# Altium project DSO_Project.PrjPCB
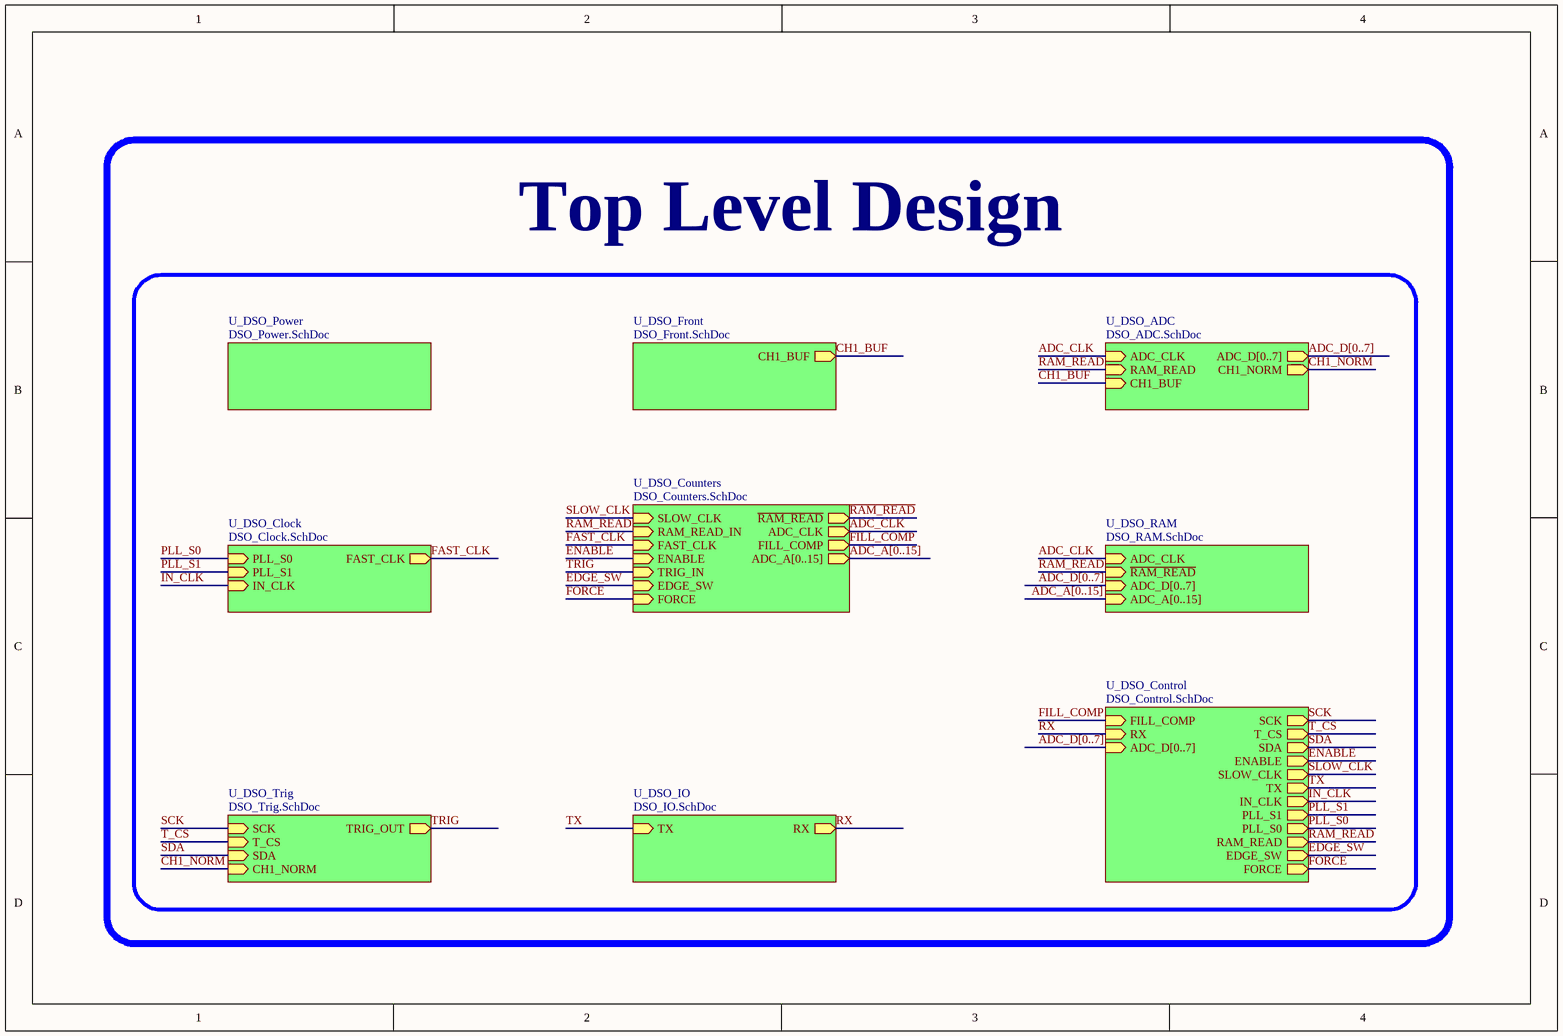
[diagram p0: DSO_Top.SchDoc]
11 sheets, 131 parts. Net scope: hierarchical (ports join the sheet entries above them; power ports are global).
Board file: DSO.PcbDoc
Sheets:
  DSO_Top.SchDoc
    U_DSO_ADC = DSO_ADC.SchDoc
    U_DSO_Clock = DSO_Clock.SchDoc
    U_DSO_Control = DSO_Control.SchDoc
    U_DSO_Counters = DSO_Counters.SchDoc
      U_DSO_CPLD = DSO_CPLD.SchDoc
    U_DSO_Front = DSO_Front.SchDoc
    U_DSO_IO = DSO_IO.SchDoc
    U_DSO_Power = DSO_Power.SchDoc
    U_DSO_RAM = DSO_RAM.SchDoc
    U_DSO_Trig = DSO_Trig.SchDoc

## Sheet DSO_Top.SchDoc: Schematic_Name
size A4; CompanyName: University of Melbourne; Engineer: Your Name Here; DocumentNumber: 1; Revision: 0.1; SheetNumber: 1; SheetTotal: 1; Title_Project: Project_Title; StudentNo: Student No.

### Sub-sheets
U_DSO_ADC = DSO_ADC.SchDoc: ADC_CLK (in), ADC_D[0..7] (out), RAM_READ (in), CH1_BUF (in), CH1_NORM (out)
U_DSO_Clock = DSO_Clock.SchDoc: FAST_CLK (out), PLL_S0 (in), IN_CLK (in), PLL_S1 (in)
U_DSO_Control = DSO_Control.SchDoc: SCK (out), T_CS (out), SDA (out), ENABLE (out), FILL_COMP (in), SLOW_CLK (out), TX (out), RX (in), IN_CLK (out), PLL_S1 (out), PLL_S0 (out), RAM_READ (out), ADC_D[0..7] (in), EDGE_SW (out), FORCE (out)
U_DSO_Counters = DSO_Counters.SchDoc: SLOW_CLK (in), ~{RAM_READ} (out), ADC_CLK (out), RAM_READ_IN (in), FAST_CLK (in), FILL_COMP (out), ENABLE (in), TRIG_IN (in), EDGE_SW (in), FORCE (in), ADC_A[0..15] (out)
U_DSO_Front = DSO_Front.SchDoc: CH1_BUF (out)
U_DSO_IO = DSO_IO.SchDoc: TX (in), RX (out)
U_DSO_Power = DSO_Power.SchDoc: no entries
U_DSO_RAM = DSO_RAM.SchDoc: ADC_CLK (in), ~{RAM_READ} (in), ADC_D[0..7] (in), ADC_A[0..15] (in)
U_DSO_Trig = DSO_Trig.SchDoc: TRIG_OUT (out), SCK (in), T_CS (in), SDA (in), CH1_NORM (in)

### Nets
ADC_CLK: sheet U_DSO_ADC/ADC_CLK, sheet U_DSO_Counters/ADC_CLK, sheet U_DSO_RAM/ADC_CLK
CH1_BUF: sheet U_DSO_ADC/CH1_BUF, sheet U_DSO_Front/CH1_BUF
CH1_NORM: sheet U_DSO_ADC/CH1_NORM, sheet U_DSO_Trig/CH1_NORM
EDGE_SW: sheet U_DSO_Control/EDGE_SW, sheet U_DSO_Counters/EDGE_SW
ENABLE: sheet U_DSO_Control/ENABLE, sheet U_DSO_Counters/ENABLE
FAST_CLK: sheet U_DSO_Clock/FAST_CLK, sheet U_DSO_Counters/FAST_CLK
FILL_COMP: sheet U_DSO_Control/FILL_COMP, sheet U_DSO_Counters/FILL_COMP
FORCE: sheet U_DSO_Control/FORCE, sheet U_DSO_Counters/FORCE
IN_CLK: sheet U_DSO_Clock/IN_CLK, sheet U_DSO_Control/IN_CLK
PLL_S0: sheet U_DSO_Clock/PLL_S0, sheet U_DSO_Control/PLL_S0
PLL_S1: sheet U_DSO_Clock/PLL_S1, sheet U_DSO_Control/PLL_S1
~{RAM_READ}: sheet U_DSO_Counters/~{RAM_READ}, sheet U_DSO_RAM/~{RAM_READ}
RAM_READ: sheet U_DSO_ADC/RAM_READ, sheet U_DSO_Control/RAM_READ, sheet U_DSO_Counters/RAM_READ_IN
RX: sheet U_DSO_Control/RX, sheet U_DSO_IO/RX
SCK: sheet U_DSO_Control/SCK, sheet U_DSO_Trig/SCK
SDA: sheet U_DSO_Control/SDA, sheet U_DSO_Trig/SDA
SLOW_CLK: sheet U_DSO_Control/SLOW_CLK, sheet U_DSO_Counters/SLOW_CLK
T_CS: sheet U_DSO_Control/T_CS, sheet U_DSO_Trig/T_CS
TRIG: sheet U_DSO_Counters/TRIG_IN, sheet U_DSO_Trig/TRIG_OUT
TX: sheet U_DSO_Control/TX, sheet U_DSO_IO/TX

### Buses and harness runs
bus ADC_A[0..15] = sheet U_DSO_Counters/ADC_A[0..15]
bus ADC_A[0..15] = sheet U_DSO_RAM/ADC_A[0..15]
bus ADC_D[0..7] = sheet U_DSO_ADC/ADC_D[0..7]
bus ADC_D[0..7] = sheet U_DSO_Control/ADC_D[0..7]
bus ADC_D[0..7] = sheet U_DSO_RAM/ADC_D[0..7]

### Notes on the sheet
- Top Level Design

## Sheet DSO_ADC.SchDoc: Schematic_Name
size A4; CompanyName: University of Melbourne; Engineer: Your Name Here; DocumentNumber: 1; Revision: 0.1; SheetNumber: 1; SheetTotal: 1; Title_Project: Project_Title; StudentNo: Student No.
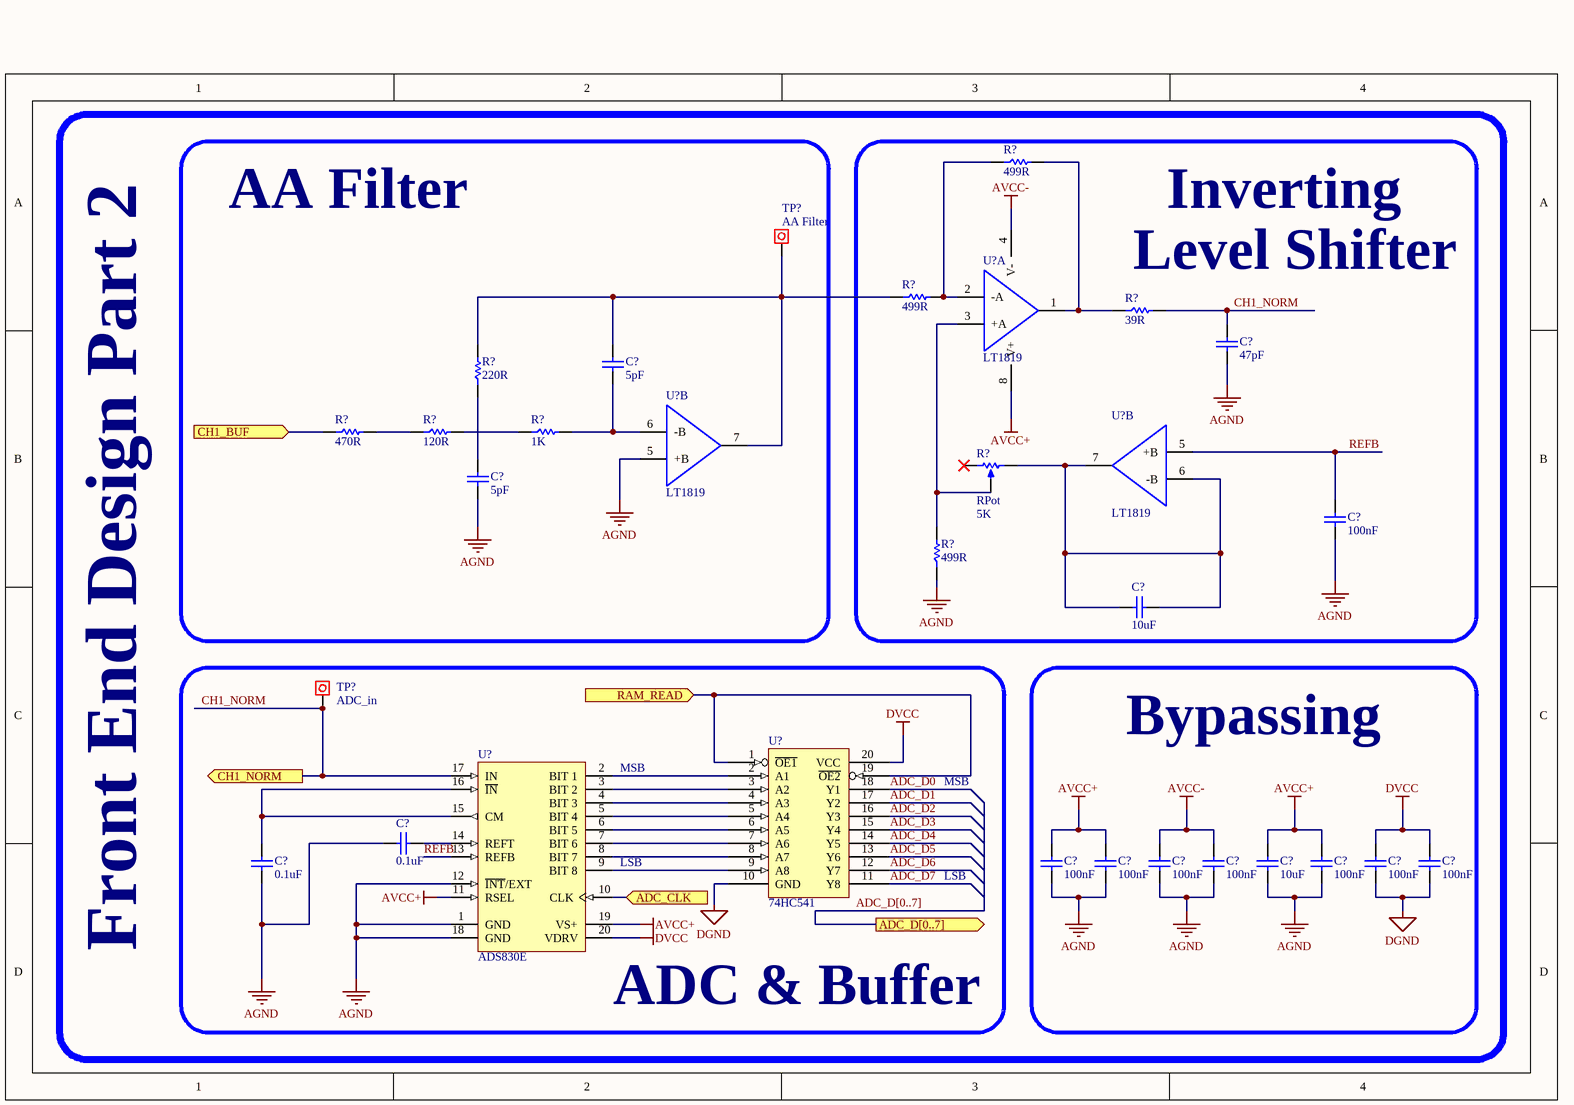
[diagram p1: DSO_ADC.SchDoc]

### Parts
(Parts that share a designator on the sheet are numbered #1, #2 ... from top to bottom, then left to right.)
C?#1  47pF  [0805C]
C?#2  5pF  [0805C]
C?#3  5pF  [0805C]
C?#4  100nF  [0805C]
C?#5  10uF  [0805C]
C?#6  0.1uF  [0805C]
C?#7  100nF  [0805C]
C?#8  100nF  [0805C]
C?#9  100nF  [0805C]
C?#10  100nF  [0805C]
C?#11  10uF  [0805C]
C?#12  100nF  [0805C]
C?#13  100nF  [0805C]
C?#14  100nF  [0805C]
C?#15  0.1uF  [0805C]
R?#1  499R  [0805]
R?#2  499R  [0805]
R?#3  39R  [0805]
R?#4  220R  [0805]
R?#5  470R  [0805]
R?#6  120R  [0805]
R?#7  1K  [0805]
R?#8  RPot  value 5K  [VR5]
R?#9  499R  [0805]
TP?#1  value AA Filter  [Testpoin]  (hidden comment: INPUT)
TP?#2  value ADC_in  [Testpoin]  (hidden comment: INPUT)
U?#1  LT1819  [SOIC-8]  (part A of 2)
U?#2  LT1819  [SOIC-8]  (part B of 2)
U?#3  LT1819  [SOIC-8]  (part B of 2)
U?#4  ADS830E  [TI-DBQ20_L]
U?#5  74HC541  [SOT163-1_N]

### Blocks framed on the sheet
AA Filter: C?#2 C?#3 R?#4-R?#7 TP?#1 U?#3
ADC & Buffer: C?#6 C?#15 TP?#2 U?#4 U?#5
Bypassing: C?#7-C?#14

### Ports
ADC_CLK (in), ADC_D[0..7] (out), CH1_BUF (in), CH1_NORM (out), RAM_READ (in)

### Nets
AGND: C?#1.2 C?#3.2 C?#4.2 C?#6.1 C?#7.1 C?#8.1 C?#9.1 C?#10.1 C?#11.1 C?#12.1 C?#15.2 R?#9.1 U?#3.5(+B) U?#4.1(GND) U?#4.12(~{INT}/EXT) U?#4.18(GND)
AVCC+: C?#7.2 C?#8.2 C?#11.2 C?#12.2 U?#1.8(V+) U?#4.11(RSEL) U?#4.19(VS+)
AVCC-: C?#9.2 C?#10.2 U?#1.4(V-)
DGND: C?#13.1 C?#14.1 U?#5.10(GND)
DVCC: C?#13.2 C?#14.2 U?#4.20(VDRV) U?#5.20(VCC)
ADC_CLK: U?#4.10(CLK) ; port ADC_CLK
ADC_D0: U?#5.18(Y1)
ADC_D1: U?#5.17(Y2)
ADC_D2: U?#5.16(Y3)
ADC_D3: U?#5.15(Y4)
ADC_D4: U?#5.14(Y5)
ADC_D5: U?#5.13(Y6)
ADC_D6: U?#5.12(Y7)
ADC_D7: U?#5.11(Y8)
CH1_BUF: R?#5.1 ; port CH1_BUF
CH1_NORM: C?#1.1 R?#3.2 TP?#2.1 U?#4.17(IN) ; port CH1_NORM
RAM_READ: U?#5.1(~{OE1}) U?#5.19(~{OE2}) ; port RAM_READ
REFB: C?#4.1 U?#2.5(+B) U?#4.13(REFB)
NetC?#2_1: C?#2.1 R?#2.1 R?#4.2 TP?#1.1 U?#3.7(OUTB)
NetC?#2_2: C?#2.2 R?#7.2 U?#3.6(-B)
NetC?#3_1: C?#3.1 R?#4.1
NetC?#5_1: C?#5.1 C?#5.2 R?#8.3(BOT) U?#2.6(-B) U?#2.7(OUTB)
NetC?#6_2: C?#6.2 U?#4.15(CM) U?#4.16(~{IN})
NetC?#15_1: C?#15.1 U?#4.14(REFT)
NetR?#1_1: R?#1.1 R?#2.2 U?#1.2(-A)
NetR?#1_2: R?#1.2 R?#3.1 U?#1.1(OUTA)
NetR?#5_2: R?#5.2 R?#6.1
NetR?#6_2: R?#6.2 R?#7.1
NetR?#8_2: R?#8.2(TAP) R?#9.2 U?#1.3(+A)
NetU?#4_2: U?#4.2(BIT_1) U?#5.2(A1)
NetU?#4_3: U?#4.3(BIT_2) U?#5.3(A2)
NetU?#4_4: U?#4.4(BIT_3) U?#5.4(A3)
NetU?#4_5: U?#4.5(BIT_4) U?#5.5(A4)
NetU?#4_6: U?#4.6(BIT_5) U?#5.6(A5)
NetU?#4_7: U?#4.7(BIT_6) U?#5.7(A6)
NetU?#4_8: U?#4.8(BIT_7) U?#5.8(A7)
NetU?#4_9: U?#4.9(BIT_8) U?#5.9(A8)

Not connected (* = marked no-connect by the designer): R?#8 1(TOP)*

### Buses and harness runs
bus ADC_D[0..7] = port ADC_D[0..7]

### Notes on the sheet
- Inverting
- (near R?#3) Level Shifter
- (near U?#4) MSB
- MSB
- (near U?#4) LSB
- LSB
- Front End Design Part 2

### Library data of the parts
C?#1-C?#15 = C: Capacitor; Reviewed by: RM - 2018/08/05; Revision: July-2002: Re-released for DXP Platform.; Supplier 1: *; Supplier Part Number 1: *
  C?#1: Value: 47pF
  C?#2 C?#3: Value: 5pF
  C?#4 C?#7-C?#10 C?#12-C?#14: Value: 100nF
  C?#5 C?#11: Value: 10uF
  C?#6 C?#15: Value: 0.1uF
R?#1-R?#7 R?#9 = R: Resistor; Reviewed by: RM - 2018/08/05; Supplier 1: *; Suppler Part Number 1: *
  R?#1 R?#2 R?#9: Value: 499R
  R?#3: Value: 39R
  R?#4: Value: 220R
  R?#5: Value: 470R
  R?#6: Value: 120R
  R?#7: Value: 1K
R?#8 = RPot: Potentiometer; Sim Note: Enter the Resistance value and the set point into parameter fields.; Set Position: 0.5; Published: 8-Jun-2000; LatestRevisionDate: 17-Jul-2002; LatestRevisionNote: Re-released for DXP Platform.; PackageReference: VR5; Publisher: Altium Limited; PackageDescription: Variable Resistor, Thru-Hole; 3 Leads
TP?#1 TP?#2 = Test Point: Pad
U?#1-U?#3 = LT1819: OpAmp High Frequency Dual; Reviewed by: RM - 2018/08/05; Supplier 1: Digi-Key; Supplier Part Number 1: LT1819CMS8#PBF-ND
U?#4 = ADS830E: 8-Bit, 60 MSPS ADC Single-Ended / Differential Input, Internal / External Reference and Programmble Input Range, -40 to 85 degC, 20-pin SOP (DBQ20), Green (RoHS & no Sb/Br); Reviewed by: RM - 2018/08/05; ComponentLink2URL: http://www.ti.com/general/docs/lit/getliterature.tsp?genericPartNumber=ADS830&fileType=pdf; ComponentLink2Description: Datasheet; ComponentLink1URL: http://www.ti.com/; ComponentLink3URL: http://www.ti.com/litv/pdf/mpds210a; ComponentLink3Description: Package Specification; ComponentLink1Description: Manufacturer URL; Supplier 1: Digi-Key; Supplier Part Number 1: ADS830E-ND
U?#5 = 74HC541: (ADV) Octal Buffer, Line Driver; Reviewed by: RM - 2018/08/05; Supplier 1: Digi-Key; Supplier Part Number 1: 296-1202-1-ND

## Sheet DSO_Clock.SchDoc: Schematic_Name
size A4; CompanyName: University of Melbourne; Engineer: Your Name Here; DocumentNumber: 1; Revision: 0.1; SheetNumber: 1; SheetTotal: 1; Title_Project: Project_Title; StudentNo: Student No.
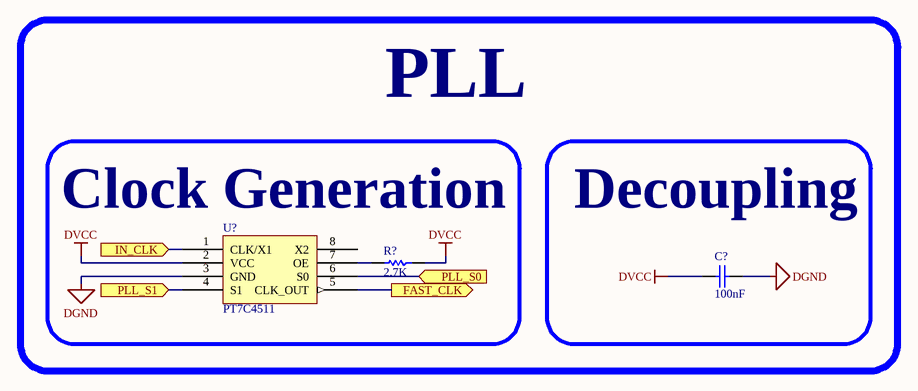
[diagram p2: DSO_Clock.SchDoc]

### Parts
(Parts that share a designator on the sheet are numbered #1, #2 ... from top to bottom, then left to right.)
C?#16  100nF  [0805C]
R?#10  2.7K  [0805]
U?#6  PT7C4511  [SOIC-8]

### Blocks framed on the sheet
Clock Generation: R?#10 U?#6
Decoupling: C?#16

### Ports
FAST_CLK (out), IN_CLK (in), PLL_S0 (in), PLL_S1 (in)

### Nets
DGND: C?#16.1 U?#6.3(GND)
DVCC: C?#16.2 R?#10.1 U?#6.2(VCC)
FAST_CLK: U?#6.5(CLK_OUT) ; port FAST_CLK
IN_CLK: U?#6.1(CLK/X1) ; port IN_CLK
PLL_S0: U?#6.6(S0) ; port PLL_S0
PLL_S1: U?#6.4(S1) ; port PLL_S1
NetR?#10_2: R?#10.2 U?#6.7(OE)

Not connected (* = marked no-connect by the designer): U?#6 8(X2)

### Notes on the sheet
- PLL

### Library data of the parts
C?#16 = C: Capacitor; Reviewed by: RM - 2018/08/05; Revision: July-2002: Re-released for DXP Platform.; Supplier 1: *; Supplier Part Number 1: *; Value: 100nF
R?#10 = R: Resistor; Reviewed by: RM - 2018/08/05; Supplier 1: *; Suppler Part Number 1: *; Value: 2.7K
U?#6 = PT7C4511: PLL Clock Multiplier; Reviewed by: RM - 2018/08/05; Supplier 1: Digi-Key; Supplier Part Number 1: PT7C4511WEXDICT-ND

## Sheet DSO_Control.SchDoc: Schematic_Name
size A4; CompanyName: University of Melbourne; Engineer: Your Name Here; DocumentNumber: 1; Revision: 0.1; SheetNumber: 1; SheetTotal: 1; Title_Project: Project_Title; StudentNo: Student No.
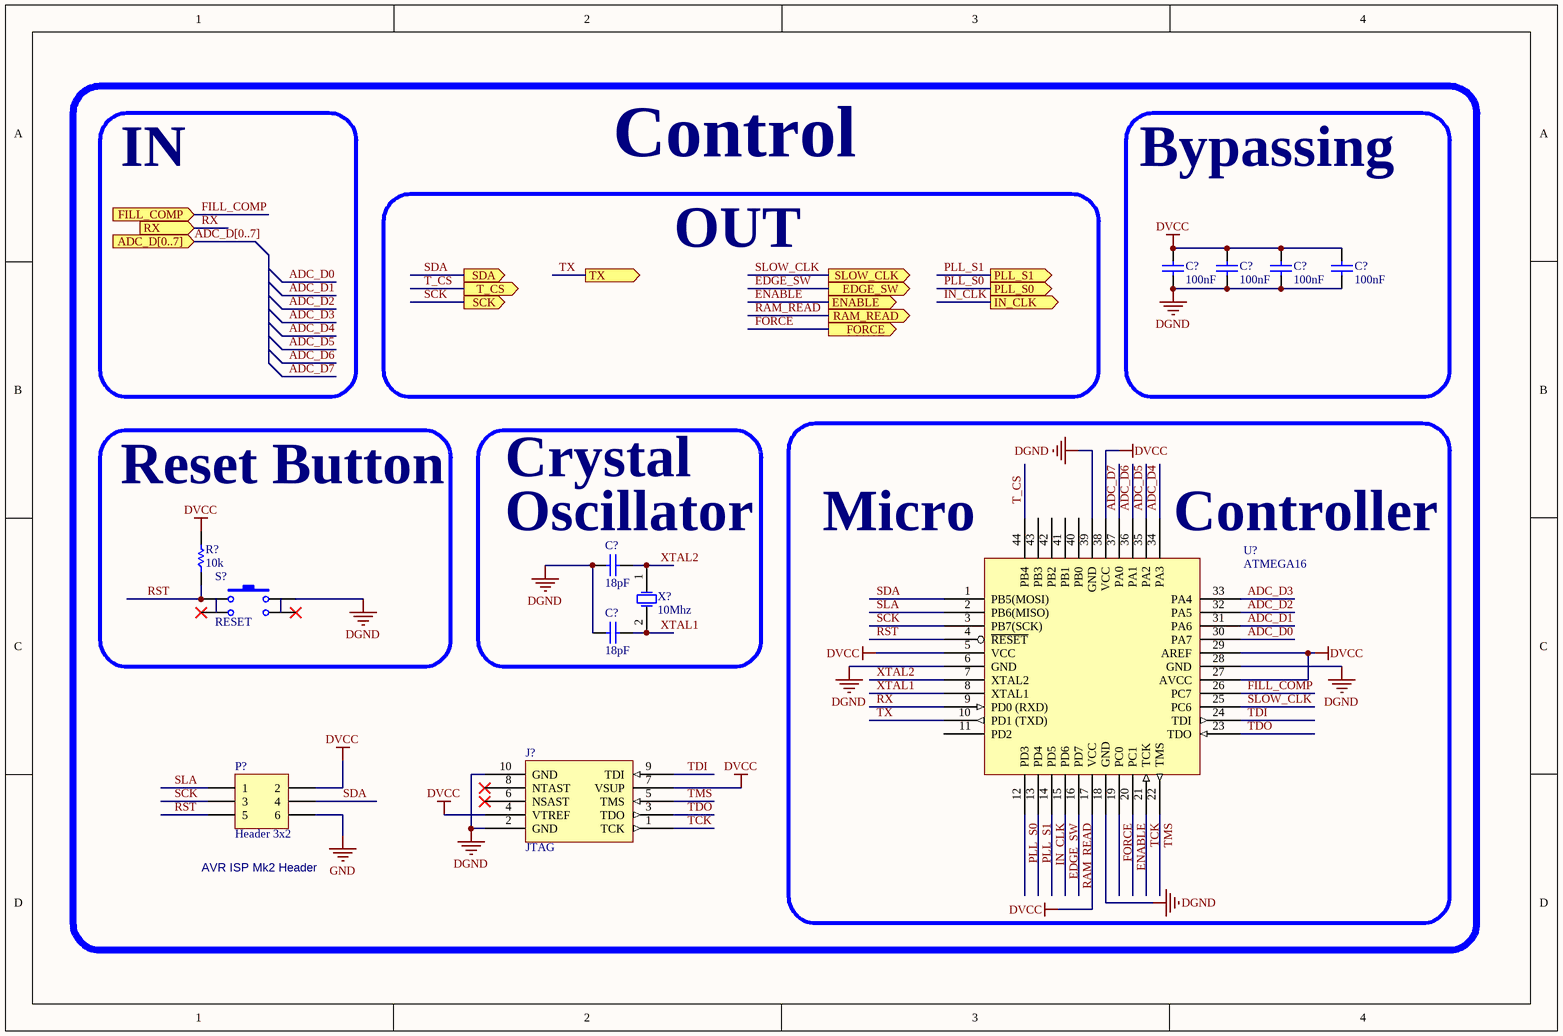
[diagram p3: DSO_Control.SchDoc]

### Parts
(Parts that share a designator on the sheet are numbered #1, #2 ... from top to bottom, then left to right.)
C?#17  100nF  [0805C]
C?#18  100nF  [0805C]
C?#19  100nF  [0805C]
C?#20  100nF  [0805C]
C?#21  18pF  [0805C]
C?#22  18pF  [0805C]
J?#1  JTAG  [BOXEDVERT10]
P?#1  Header 3x2  [HDR3x2]
R?#11  10k  [0805]
S?  RESET  [SPST PB SWITCH SMD]
U?#7  ATMEGA16  [QFP-48]
X?  10Mhz  [XTAL_FLAT_SMD]

### Blocks framed on the sheet
Control: C?#21 C?#22 J?#1 P?#1 U?#7 X?
Bypassing: C?#17-C?#20
Reset Button: R?#11 S?

### Ports
ADC_D[0..7] (in), EDGE_SW (out), ENABLE (out), FILL_COMP (in), FORCE (out), IN_CLK (out), PLL_S0 (out), PLL_S1 (out), RAM_READ (out), RX (in), SCK (out), SDA (out), SLOW_CLK (out), T_CS (out), TX (out)

### Nets
DGND: C?#17.2 C?#18.2 C?#19.2 C?#20.2 C?#21.2 C?#22.2 J?#1.2(GND) J?#1.10(GND) S?.2 U?#7.6(GND) U?#7.18(GND) U?#7.28(GND) U?#7.39(GND)
DVCC: C?#17.1 C?#18.1 C?#19.1 C?#20.1 J?#1.4(VTREF) J?#1.7(VSUP) P?#1.2 R?#11.2 U?#7.5(VCC) U?#7.17(VCC) U?#7.27(AVCC) U?#7.29(AREF) U?#7.38(VCC)
GND: P?#1.6
ADC_D0: U?#7.30(PA7)
ADC_D1: U?#7.31(PA6)
ADC_D2: U?#7.32(PA5)
ADC_D3: U?#7.33(PA4)
ADC_D4: U?#7.34(PA3)
ADC_D5: U?#7.35(PA2)
ADC_D6: U?#7.36(PA1)
ADC_D7: U?#7.37(PA0)
EDGE_SW: U?#7.15(PD6) ; port EDGE_SW
ENABLE: U?#7.20(PC1) ; port ENABLE
FILL_COMP: U?#7.26(PC7) ; port FILL_COMP
FORCE: U?#7.19(PC0) ; port FORCE
IN_CLK: U?#7.14(PD5) ; port IN_CLK
PLL_S0: U?#7.12(PD3) ; port PLL_S0
PLL_S1: U?#7.13(PD4) ; port PLL_S1
RAM_READ: U?#7.16(PD7) ; port RAM_READ
RST: P?#1.5 R?#11.1 S?.1 U?#7.4(~{RESET})
RX: U?#7.9(PD0_(RXD)) ; port RX
SCK: P?#1.3 U?#7.3(PB7(SCK)) ; port SCK
SDA: P?#1.4 U?#7.1(PB5(MOSI)) ; port SDA
SLA: P?#1.1 U?#7.2(PB6(MISO))
SLOW_CLK: U?#7.25(PC6) ; port SLOW_CLK
T_CS: U?#7.44(PB4) ; port T_CS
TCK: J?#1.1(TCK) U?#7.21(TCK)
TDI: J?#1.9(TDI) U?#7.24(TDI)
TDO: J?#1.3(TDO) U?#7.23(TDO)
TMS: J?#1.5(TMS) U?#7.22(TMS)
TX: U?#7.10(PD1_(TXD)) ; port TX
XTAL1: C?#22.1 U?#7.8(XTAL1) X?.2(OSC2)
XTAL2: C?#21.1 U?#7.7(XTAL2) X?.1(OSC1)

Not connected (* = marked no-connect by the designer): J?#1 6(NSAST)* 8(NTAST)*; S? 3* 4*; U?#7 11(PD2) 40(PB0) 41(PB1) 42(PB2) 43(PB3)

### Buses and harness runs
bus ADC_D[0..7] = port ADC_D[0..7]

### Notes on the sheet
- IN
- OUT
- Crystal
- (near C?#21) Oscillator
- (near U?#7) Micro
- (near U?#7) Controller
- (near P?#1) AVR ISP Mk2 Header

### Library data of the parts
C?#17-C?#22 = C: Capacitor; Reviewed by: RM - 2018/08/05; Revision: July-2002: Re-released for DXP Platform.; Supplier 1: *; Supplier Part Number 1: *
  C?#17-C?#20: Value: 100nF
  C?#21 C?#22: Value: 18pF
J?#1 = JTAG_CON: Reviewed by: RM - 2018/08/05; Supplier 1: Digi-Key; Supplier Part Number 1: OR896-ND
P?#1 = Header 3x2: Header, 5-Pin; Reviewed by: RM - 2018/08/05; Supplier 1: Digi-Key; Supplier Part Number 1: 952-2121-ND
R?#11 = R: Resistor; Reviewed by: RM - 2018/08/05; Value: 10k; Supplier 1: *; Suppler Part Number 1: *
S? = SW_PB_1P1T4: Momentary Push Button Switch 1P 1T 2pins; Reviewed by: RM - 2018/08/05; Revision: July-2002: Re-released for DXP Platform.; Supplier 1: Digi-Key; Supplier Part Number 1: CKN9085CT-ND
U?#7 = ATMEGA16: ATMEGA16 Microcontroller; Reviewed by: RM - 2018/08/05; Supplier 1: Digi-Key; Supplier Part Number 1: ATMEGA16A-AU-ND
X? = XTAL: Crystal Oscillator; Reviewed by: RM - 2018/08/05; Revision: July-2002: Re-released for DXP Platform.; Supplier 1: Digi-Key; Supplier Part Number 1: 887-1080-1-ND

## Sheet DSO_Counters.SchDoc: Schematic_Name
size A4; CompanyName: University of Melbourne; DrawnBy: Student_#; Engineer: Your Name Here; Organization: University of Melbourne; DocumentNumber: 5; Revision: 0.1; SheetNumber: 5; SheetTotal: 10; Title_Project: Project_Title
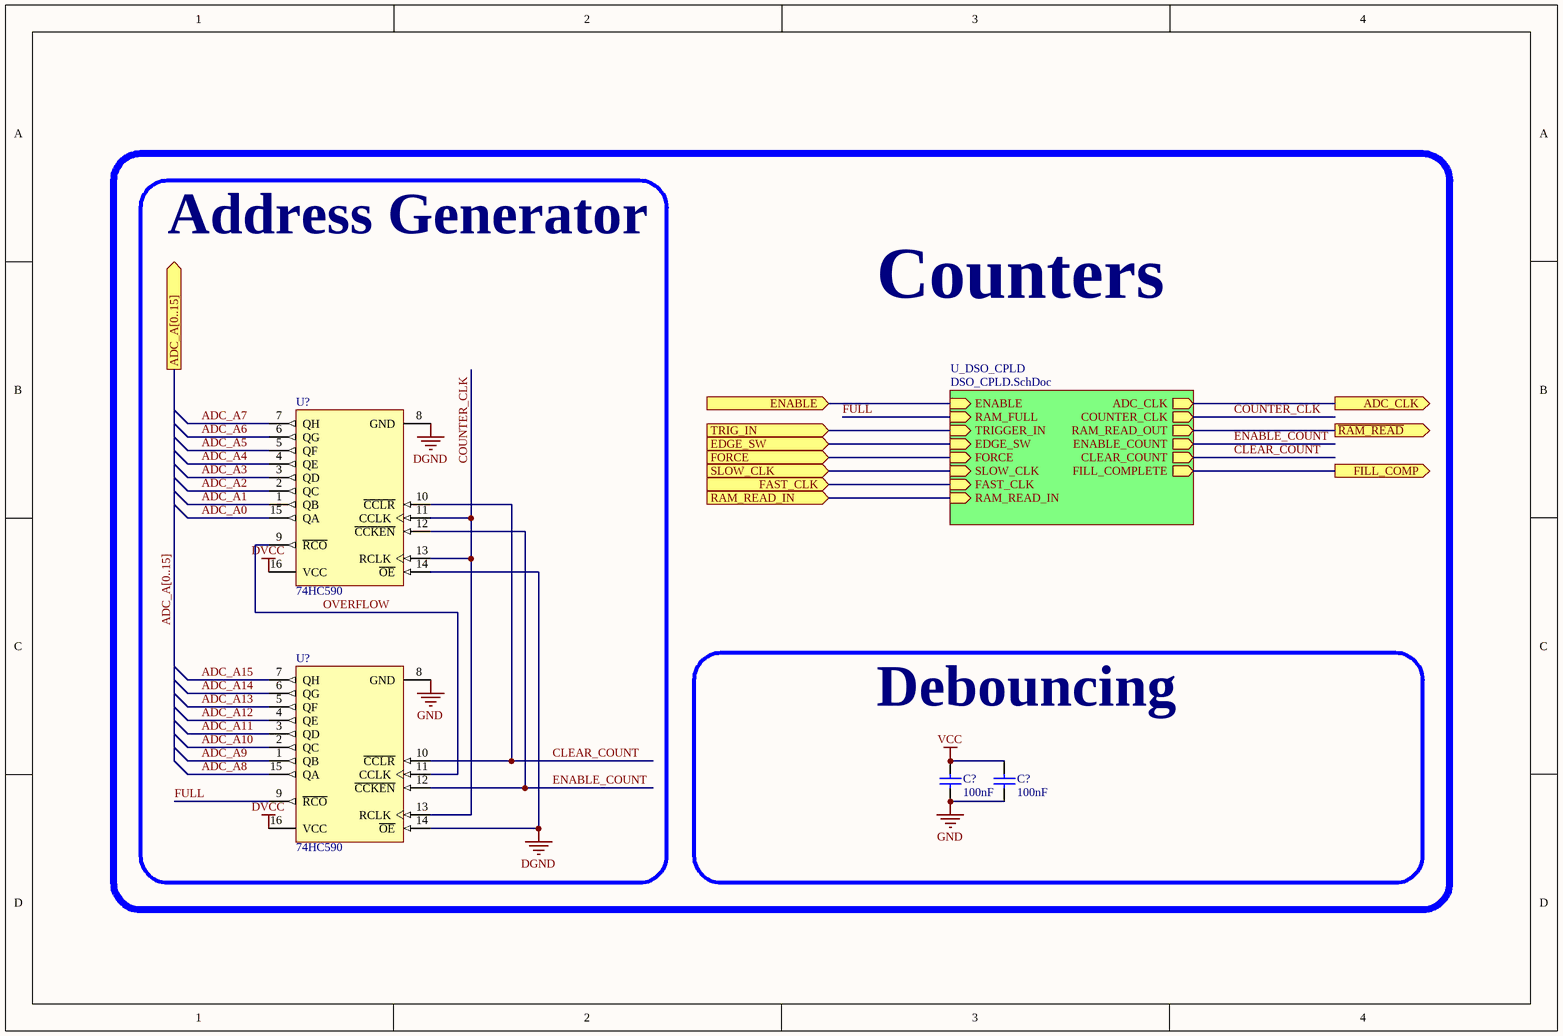
[diagram p4: DSO_Counters.SchDoc]

### Parts
(Parts that share a designator on the sheet are numbered #1, #2 ... from top to bottom, then left to right.)
C?#23  100nF  [0805C]
C?#24  100nF  [0805C]
U?#8  74HC590  [SOIC-16]
U?#9  74HC590  [SOIC-16]

### Blocks framed on the sheet
Address Generator: U?#8 U?#9
Debouncing: C?#23 C?#24

### Sub-sheets
U_DSO_CPLD = DSO_CPLD.SchDoc: ENABLE (in), RAM_FULL (in), TRIGGER_IN (in), EDGE_SW (in), FORCE (in), SLOW_CLK (in), FAST_CLK (in), RAM_READ_IN (in), ADC_CLK (out), COUNTER_CLK (out), RAM_READ_OUT (out), ENABLE_COUNT (out), CLEAR_COUNT (out), FILL_COMPLETE (out)

### Ports
ADC_A[0..15] (out), ADC_CLK (out), EDGE_SW (in), ENABLE (in), FAST_CLK (in), FILL_COMP (out), FORCE (in), RAM_READ_IN (in), SLOW_CLK (in), TRIG_IN (in), ~{RAM_READ} (out)

### Nets
DGND: U?#8.8(GND) U?#8.14(~{OE}) U?#9.14(~{OE})
DVCC: U?#8.16(VCC) U?#9.16(VCC)
GND: C?#23.2 C?#24.2 U?#9.8(GND)
VCC: C?#23.1 C?#24.1
ADC_A0: U?#8.15(QA)
ADC_A1: U?#8.1(QB)
ADC_A2: U?#8.2(QC)
ADC_A3: U?#8.3(QD)
ADC_A4: U?#8.4(QE)
ADC_A5: U?#8.5(QF)
ADC_A6: U?#8.6(QG)
ADC_A7: U?#8.7(QH)
ADC_A8: U?#9.15(QA)
ADC_A9: U?#9.1(QB)
ADC_A10: U?#9.2(QC)
ADC_A11: U?#9.3(QD)
ADC_A12: U?#9.4(QE)
ADC_A13: U?#9.5(QF)
ADC_A14: U?#9.6(QG)
ADC_A15: U?#9.7(QH)
ADC_CLK: port ADC_CLK, sheet U_DSO_CPLD/ADC_CLK
CLEAR_COUNT: U?#8.10(~{CCLR}) U?#9.10(~{CCLR}) ; sheet U_DSO_CPLD/CLEAR_COUNT
COUNTER_CLK: U?#8.11(CCLK) U?#8.13(RCLK) U?#9.13(RCLK) ; sheet U_DSO_CPLD/COUNTER_CLK
EDGE_SW: port EDGE_SW, sheet U_DSO_CPLD/EDGE_SW
ENABLE: port ENABLE, sheet U_DSO_CPLD/ENABLE
ENABLE_COUNT: U?#8.12(~{CCKEN}) U?#9.12(~{CCKEN}) ; sheet U_DSO_CPLD/ENABLE_COUNT
FAST_CLK: port FAST_CLK, sheet U_DSO_CPLD/FAST_CLK
FILL_COMP: port FILL_COMP, sheet U_DSO_CPLD/FILL_COMPLETE
FORCE: port FORCE, sheet U_DSO_CPLD/FORCE
FULL: U?#9.9(~{RCO}) ; sheet U_DSO_CPLD/RAM_FULL
OVERFLOW: U?#8.9(~{RCO}) U?#9.11(CCLK)
~{RAM_READ}: port ~{RAM_READ}, sheet U_DSO_CPLD/RAM_READ_OUT
RAM_READ: port RAM_READ_IN, sheet U_DSO_CPLD/RAM_READ_IN
SLOW_CLK: port SLOW_CLK, sheet U_DSO_CPLD/SLOW_CLK
TRIG: port TRIG_IN, sheet U_DSO_CPLD/TRIGGER_IN

### Buses and harness runs
bus ADC_A[0..15] = port ADC_A[0..15]

### Notes on the sheet
- Counters

### Library data of the parts
C?#23 C?#24 = C: Capacitor; Reviewed by: RM - 2018/08/05; Revision: July-2002: Re-released for DXP Platform.; Value: 100nF; Supplier 1: *; Supplier Part Number 1: *
U?#8 U?#9 = 74HC590: 8-Bit Binary Counter Register; Reviewed by: RM - 2018/08/05; ComponentLink1Description: Manufacturer Link; ComponentLink1URL: http://www.st.com/; ComponentLink2Description: Datasheet; ComponentLink2URL: http://www.st.com/stonline/products/literature/ds/1986/m74hc590.pdf; Supplier 1: Digi-Key; Supplier Part Number 1: 296-17132-1-ND

## Sheet DSO_CPLD.SchDoc
size A4
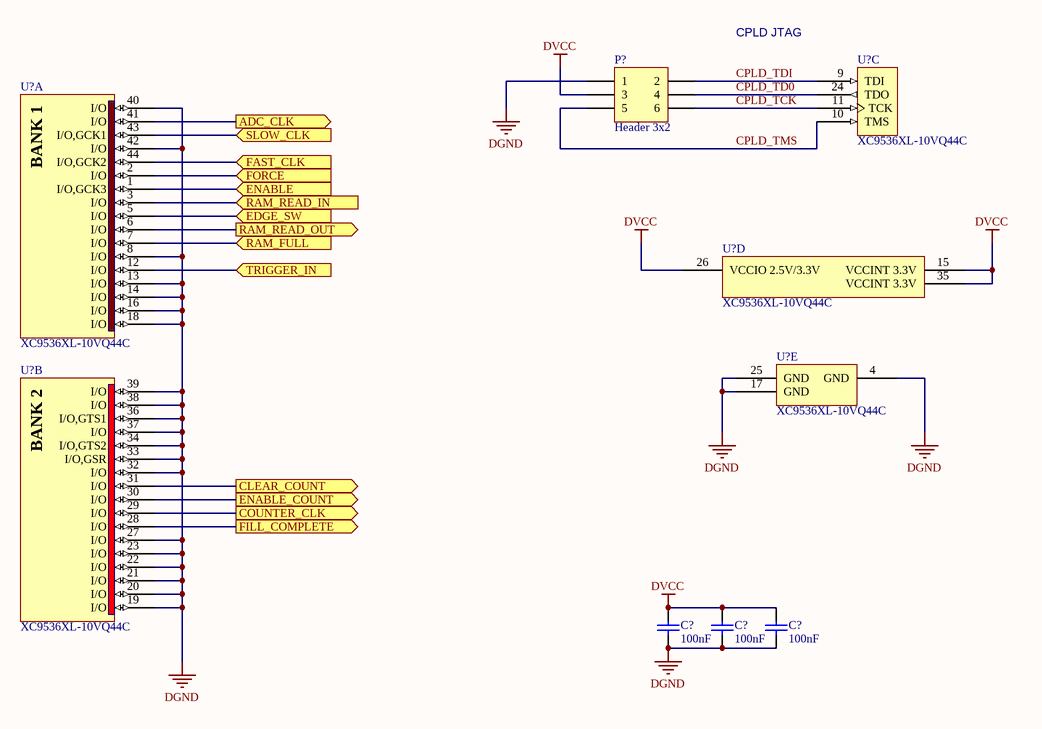
[diagram p5: DSO_CPLD.SchDoc]

### Parts
(Parts that share a designator on the sheet are numbered #1, #2 ... from top to bottom, then left to right.)
C?#25  100nF  [0805C]
C?#26  100nF  [0805C]
C?#27  100nF  [0805C]
P?#2  Header 3x2  [HDR3x2]
U?#10  XC9536XL-10VQ44C  [VQ44_L]  (part C of 5)
U?#11  XC9536XL-10VQ44C  [VQ44_L]  (part A of 5)
U?#12  XC9536XL-10VQ44C  [VQ44_L]  (part D of 5)
U?#13  XC9536XL-10VQ44C  [VQ44_L]  (part E of 5)
U?#14  XC9536XL-10VQ44C  [VQ44_L]  (part B of 5)

### Ports
ADC_CLK (out), CLEAR_COUNT (out), COUNTER_CLK (out), EDGE_SW (in), ENABLE (in), ENABLE_COUNT (out), FAST_CLK (in), FILL_COMPLETE (out), FORCE (in), RAM_FULL (in), RAM_READ_IN (in), RAM_READ_OUT (out), SLOW_CLK (in), TRIGGER_IN (in)

### Nets
DGND: C?#25.2 C?#26.2 C?#27.2 P?#2.1 U?#11.8(I/O) U?#11.13(I/O) U?#11.14(I/O) U?#11.16(I/O) U?#11.18(I/O) U?#11.40(I/O) U?#11.42(I/O) U?#13.4(GND) U?#13.17(GND) U?#13.25(GND) U?#14.19(I/O) U?#14.20(I/O) U?#14.21(I/O) U?#14.22(I/O) U?#14.23(I/O) U?#14.27(I/O) U?#14.32(I/O) U?#14.33(I/O,GSR) U?#14.34(I/O,GTS2) U?#14.36(I/O,GTS1) U?#14.37(I/O) U?#14.38(I/O) U?#14.39(I/O)
DVCC: C?#25.1 C?#26.1 C?#27.1 P?#2.3 U?#12.15(VCCINT_3.3V) U?#12.26(VCCIO_2.5V/3.3V) U?#12.35(VCCINT_3.3V)
ADC_CLK: U?#11.41(I/O) ; port ADC_CLK
CLEAR_COUNT: U?#14.31(I/O) ; port CLEAR_COUNT
COUNTER_CLK: U?#14.29(I/O) ; port COUNTER_CLK
CPLD_TCK: P?#2.6 U?#10.11(TCK)
CPLD_TD0: P?#2.4 U?#10.24(TDO)
CPLD_TDI: P?#2.2 U?#10.9(TDI)
CPLD_TMS: P?#2.5 U?#10.10(TMS)
EDGE_SW: U?#11.5(I/O) ; port EDGE_SW
ENABLE: U?#11.1(I/O,GCK3) ; port ENABLE
ENABLE_COUNT: U?#14.30(I/O) ; port ENABLE_COUNT
FAST_CLK: U?#11.44(I/O,GCK2) ; port FAST_CLK
FILL_COMP: U?#14.28(I/O) ; port FILL_COMPLETE
FORCE: U?#11.2(I/O) ; port FORCE
FULL: U?#11.7(I/O) ; port RAM_FULL
~{RAM_READ}: U?#11.6(I/O) ; port RAM_READ_OUT
RAM_READ: U?#11.3(I/O) ; port RAM_READ_IN
SLOW_CLK: U?#11.43(I/O,GCK1) ; port SLOW_CLK
TRIG: U?#11.12(I/O) ; port TRIGGER_IN

### Notes on the sheet
- CPLD JTAG
- (in symbol XC9536XL-10VQG44C, part A) BANK 1
- (in symbol XC9536XL-10VQG44C, part B) BANK 2

### Library data of the parts
C?#25-C?#27 = C: Capacitor; Reviewed by: RM - 2018/08/05; Revision: July-2002: Re-released for DXP Platform.; Value: 100nF; Supplier 1: *; Supplier Part Number 1: *
P?#2 = Header 3x2: as P?#1 on sheet DSO_Control; Supplier 1: Digi-Key; Supplier Part Number 1: 952-2121-ND
U?#10-U?#14 = XC9536XL-10VQG44C: FastFLASH XC900XL, 3.3V High-Performance 36 Macrocell CPLD, 34 User I/Os, 44-Pin VQFP, Speed Grade 10, Commercial Grade; Reviewed by: RM - 2018/08/05; Supplier 1: Digi-Key; Supplier Part Number 1: 122-1385-ND

## Sheet DSO_Front.SchDoc: Schematic_Name
size A4; CompanyName: University of Melbourne; Engineer: Your Name Here; DocumentNumber: 1; Revision: 0.1; SheetNumber: 1; SheetTotal: 1; Title_Project: Project_Title; StudentNo: Student No.
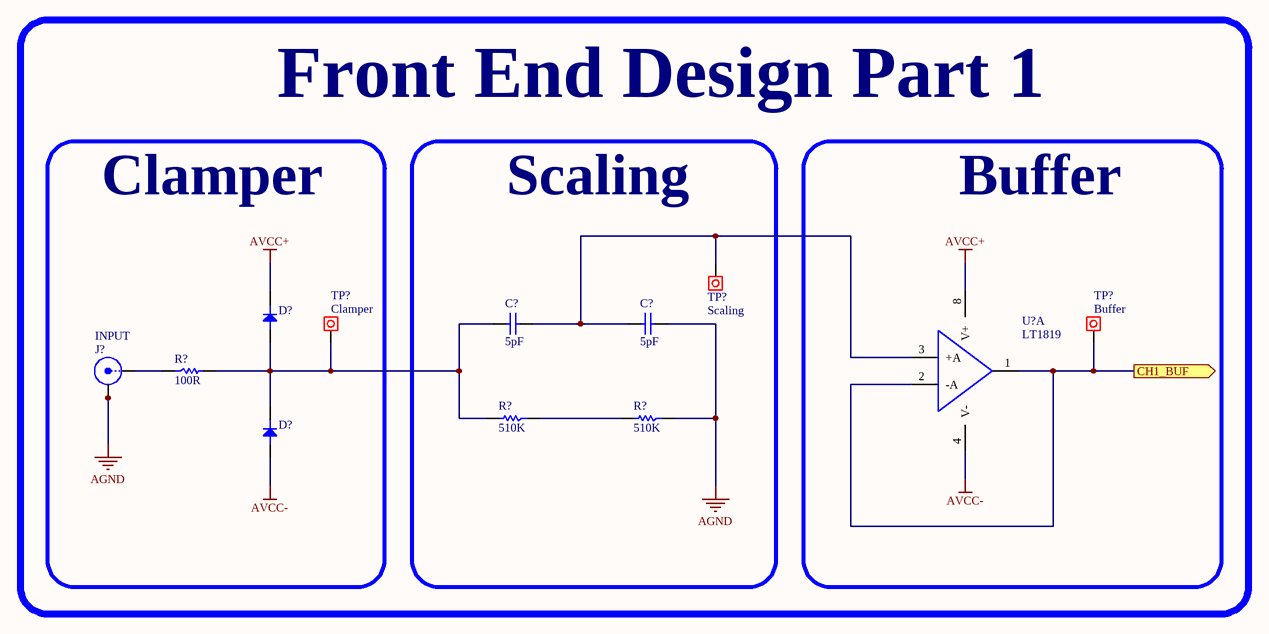
[diagram p6: DSO_Front.SchDoc]

### Parts
(Parts that share a designator on the sheet are numbered #1, #2 ... from top to bottom, then left to right.)
C?#28  5pF  [0805C]
C?#29  5pF  [0805C]
D?#1  Diode  [SOD-123]  (value not drawn)
D?#2  Diode  [SOD-123]  (value not drawn)
J?#2  INPUT  [BNC_VERT]
R?#12  100R  [0805]
R?#13  510K  [0805]
R?#14  510K  [0805]
TP?#3  value Scaling  [Testpoin]  (hidden comment: INPUT)
TP?#4  value Clamper  [Testpoin]  (hidden comment: INPUT)
TP?#5  value Buffer  [Testpoin]  (hidden comment: INPUT)
U?#15  LT1819  [SOIC-8]  (part A of 2)

### Blocks framed on the sheet
Clamper: D?#1 D?#2 J?#2 R?#12 TP?#4
Scaling: C?#28 C?#29 R?#13 R?#14 TP?#3
Buffer: TP?#5 U?#15

### Ports
CH1_BUF (out)

### Nets
AGND: C?#29.1 J?#2.2(Y) J?#2.3(Y) J?#2.4(Y) J?#2.5(Y) R?#14.1
AVCC+: D?#1.K U?#15.8(V+)
AVCC-: D?#2.A U?#15.4(V-)
CH1_BUF: TP?#5.1 U?#15.1(OUTA) U?#15.2(-A) ; port CH1_BUF
NetC?#28_1: C?#28.1 C?#29.2 TP?#3.1 U?#15.3(+A)
NetC?#28_2: C?#28.2 D?#1.A D?#2.K R?#12.2 R?#13.2 TP?#4.1
NetJ?#2_1: J?#2.1(X) R?#12.1
NetR?#13_1: R?#13.1 R?#14.2

### Notes on the sheet
- Front End Design Part 1

### Library data of the parts
C?#28 C?#29 = C: Capacitor; Reviewed by: RM - 2018/08/05; Revision: July-2002: Re-released for DXP Platform.; Supplier 1: *; Supplier Part Number 1: *; Value: 5pF
D?#1 D?#2 = D: Reviewed by: RM - 2018/08/05; Revision: July-2002: Re-released for DXP Platform.; Supplier 1: *; Supplier Part Number 1: *
J?#2 = BNC: BNC Straight; Reviewed by: RM - 2018/08/05; Supplier Part Number 1: A97581-ND; Supplier 1: Digi-Key
R?#12-R?#14 = R: Resistor; Reviewed by: RM - 2018/08/05; Supplier 1: *; Suppler Part Number 1: *
  R?#12: Value: 100R
  R?#13 R?#14: Value: 510K
TP?#3-TP?#5 = Test Point: Pad
U?#15 = LT1819: as U?#1 on sheet DSO_ADC; Supplier 1: Digi-Key; Supplier Part Number 1: LT1819CMS8#PBF-ND

## Sheet DSO_IO.SchDoc: Schematic_Name
size A4; CompanyName: University of Melbourne; Engineer: Your Name Here; DocumentNumber: 1; Revision: 0.1; SheetNumber: 1; SheetTotal: 1; Title_Project: Project_Title; StudentNo: Student No.
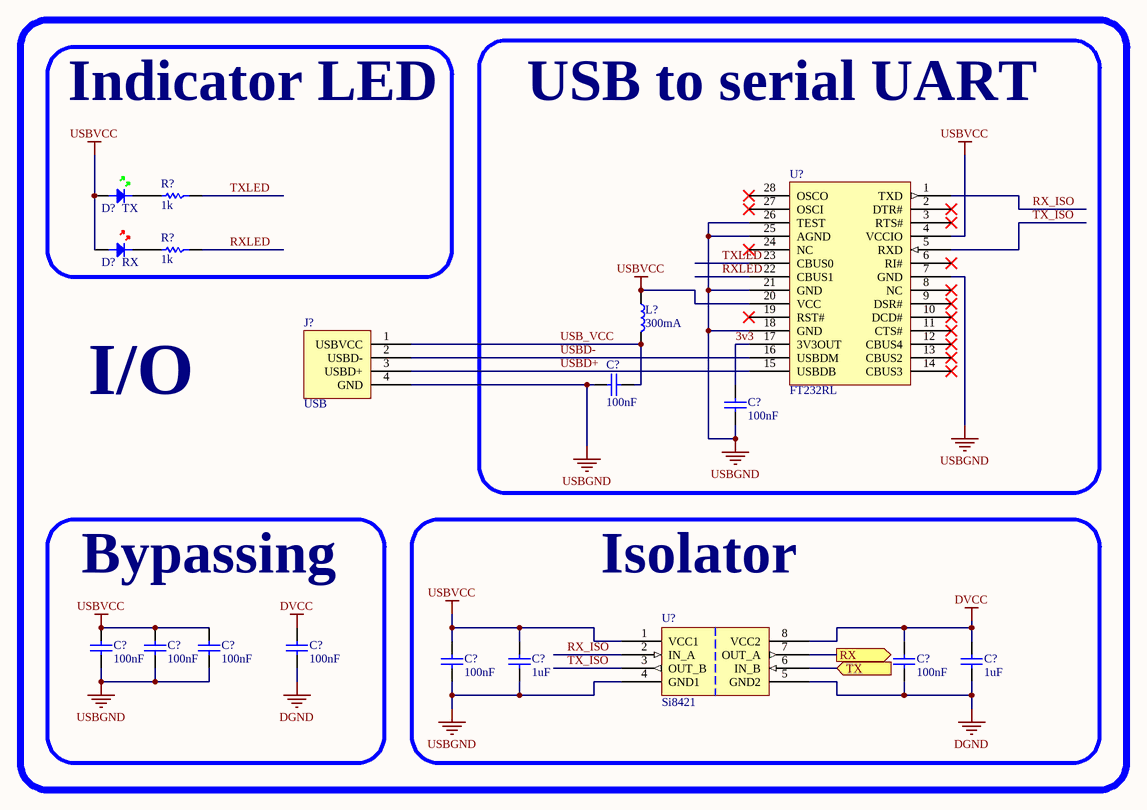
[diagram p7: DSO_IO.SchDoc]

### Parts
(Parts that share a designator on the sheet are numbered #1, #2 ... from top to bottom, then left to right.)
C?#30  100nF  [0805C]
C?#31  100nF  [0805C]
C?#32  100nF  [0805C]
C?#33  100nF  [0805C]
C?#34  100nF  [0805C]
C?#35  100nF  [0805C]
C?#36  100nF  [0805C]
C?#37  1uF  [0805C]
C?#38  100nF  [0805C]
C?#39  1uF  [0805C]
D?#3  TX  [0805D-GREEN]
D?#4  RX  [0805D-RED]
J?#3  USB  [USBPLUG]
L?#1  300mA  [0805]
R?#15  1k  [0805]
R?#16  1k  [0805]
U?#16  FT232RL  [SSOP-28]
U?#17  Si8421  [SOIC-8]

### Blocks framed on the sheet
I/O: J?#3
Indicator LED: D?#3 D?#4 R?#15 R?#16
USB to serial UART: C?#30 C?#31 L?#1 U?#16
Bypassing: C?#32-C?#35
Isolator: C?#36-C?#39 U?#17

### Ports
RX (out), TX (in)

### Nets
DGND: C?#35.2 C?#38.2 C?#39.2 U?#17.5(GND2)
DVCC: C?#35.1 C?#38.1 C?#39.1 U?#17.8(VCC2)
USBGND: C?#30.2 C?#31.2 C?#32.2 C?#33.2 C?#34.2 C?#36.2 C?#37.2 J?#3.4(GND) U?#16.7(GND) U?#16.18(GND) U?#16.21(GND) U?#16.25(AGND) U?#16.26(TEST) U?#17.4(GND1)
USBVCC: C?#32.1 C?#33.1 C?#34.1 C?#36.1 C?#37.1 D?#3.A D?#4.A L?#1.1 U?#16.4(VCCIO) U?#16.20(VCC) U?#17.1(VCC1)
3v3: C?#31.1 U?#16.17(3V3OUT)
RX: U?#17.7(OUT_A) ; port RX
RX_ISO: U?#16.1(TXD) U?#17.2(IN_A)
RXLED: R?#16.1 U?#16.22(CBUS1)
TX: U?#17.6(IN_B) ; port TX
TX_ISO: U?#16.5(RXD) U?#17.3(OUT_B)
TXLED: R?#15.1 U?#16.23(CBUS0)
USB_VCC: C?#30.1 J?#3.1(USBVCC) L?#1.2
USBD+: J?#3.3(USBD+) U?#16.15(USBDB)
USBD-: J?#3.2(USBD-) U?#16.16(USBDM)
NetD?#3_K: D?#3.K R?#15.2
NetD?#4_K: D?#4.K R?#16.2

Not connected (* = marked no-connect by the designer): U?#16 2(DTR#)* 3(RTS#)* 6(RI#)* 8(NC)* 9(DSR#)* 10(DCD#)* 11(CTS#)* 12(CBUS4)* 13(CBUS2)* 14(CBUS3)* 19(RST#)* 24(NC)* 27(OSCI)* 28(OSCO)*

### Library data of the parts
C?#30-C?#39 = C: Capacitor; Reviewed by: RM - 2018/08/05; Revision: July-2002: Re-released for DXP Platform.; Supplier 1: *; Supplier Part Number 1: *
  C?#30-C?#36 C?#38: Value: 100nF
  C?#37 C?#39: Value: 1uF
D?#3 = LED GREEN: Light Emitting Diode; Reviewed by: RM - 2018/08/05; Revision: July-2002: Re-released for DXP Platform.; Supplier 1: Digi-Key; Supplier Part Number 1: 160-1423-1-ND
D?#4 = LED RED: Light Emitting Diode; Reviewed by: RM - 2018/08/05; Revision: July-2002: Re-released for DXP Platform.; Supplier 1: Digi-Key; Supplier Part Number 1: 475-1415-1-ND
J?#3 = USBPLUG: USB B Type Connector; Reviewed by: RM - 2018/08/05; Supplier 1: Digi-Key; Supplier Part Number 1: 609-1039-ND
L?#1 = I: Inductor; Reviewed by: RM - 2018/08/05; Value: 300mA; Supplier 1: *; Supplier Part Number 1: *
R?#15 R?#16 = R: Resistor; Reviewed by: RM - 2018/08/05; Value: 1k; Supplier 1: *; Suppler Part Number 1: *
U?#16 = FT232RL: USB to Serial bridge; Reviewed by: RM - 2018/08/05; Supplier 1: Digi-Key; Supplier Part Number 1: 768-1007-1-ND
U?#17 = Si8421: Dual Channel Digital Isolator Both Ways; Reviewed by: RM - 2018/08/05; Supplier 1: Digi-Key; Supplier Part Number 1: 336-1755-5-ND

## Sheet DSO_Power.SchDoc: Schematic_Name
size A4; CompanyName: University of Melbourne; Engineer: Your Name Here; DocumentNumber: 1; Revision: 0.1; SheetNumber: 1; SheetTotal: 1; Title_Project: Project_Title; StudentNo: Student No.
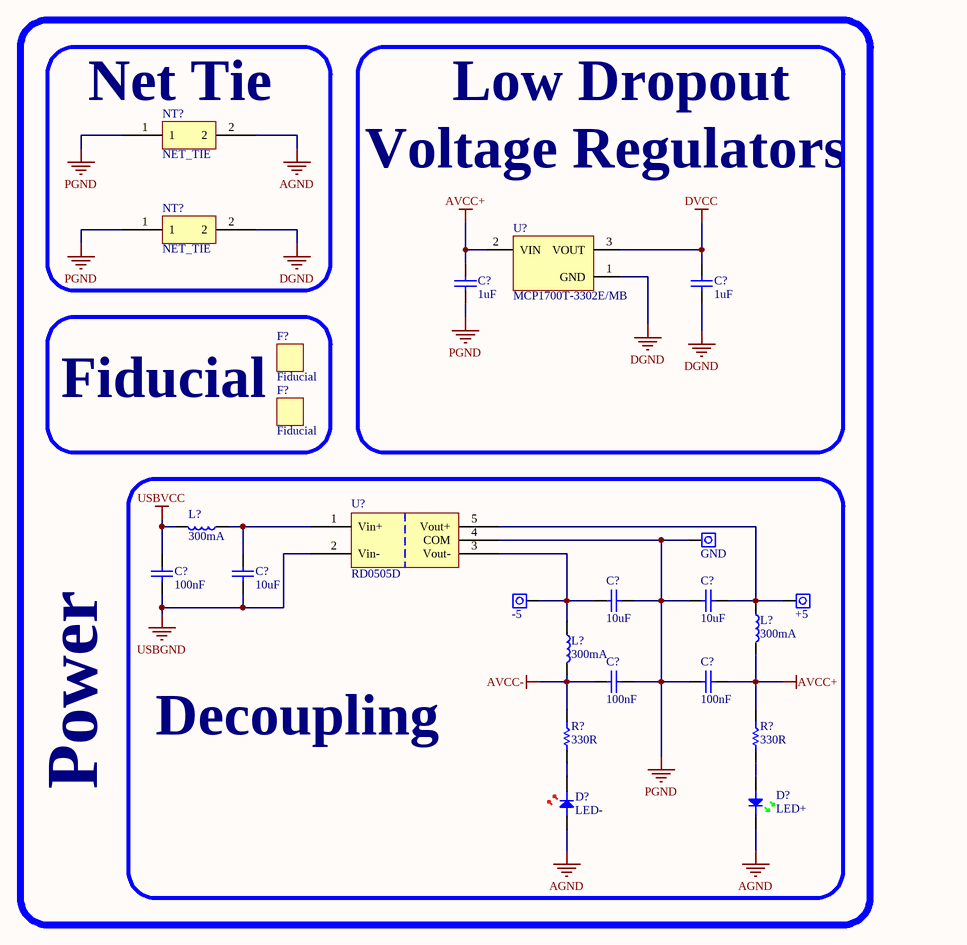
[diagram p8: DSO_Power.SchDoc]

### Parts
(Parts that share a designator on the sheet are numbered #1, #2 ... from top to bottom, then left to right.)
C?#40  1uF  [0805C]
C?#41  1uF  [0805C]
C?#42  100nF  [0805C]
C?#43  10uF  [0805C]
C?#44  10uF  [0805C]
C?#45  10uF  [0805C]
C?#46  100nF  [0805C]
C?#47  100nF  [0805C]
D?#5  LED+  [0805D-GREEN]
D?#6  LED-  [0805D-RED]
F?#1  Fiducial  [Fiducial]  (no BOM)
F?#2  Fiducial  [Fiducial]  (no BOM)
L?#2  300mA  [0805]
L?#3  300mA  [0805]
L?#4  300mA  [0805]
NT?#1  NET_TIE  [NET_TIE]  (net tie, no BOM)
NT?#2  NET_TIE  [NET_TIE]  (net tie, no BOM)
R?#17  330R  [0805]
R?#18  330R  [0805]
TP?#6  GND  [PIN 1.8mm]
TP?#7  -5  [PIN 1.8mm]
TP?#8  +5  [PIN 1.8mm]
U?#18  MCP1700T-3302E/MB  [SOT89]
U?#19  RD0505D  [SIP_NMG]

### Blocks framed on the sheet
Power: C?#40 C?#41 U?#18
Net Tie: NT?#1 NT?#2
Fiducial: F?#1 F?#2
Decoupling: C?#42-C?#47 D?#5 D?#6 L?#2-L?#4 R?#17 R?#18 TP?#6-TP?#8 U?#19

### Nets
AGND: D?#5.K D?#6.A NT?#1.2
AVCC+: C?#40.2 C?#47.1 L?#3.2 R?#18.1 U?#18.2(VIN)
AVCC-: C?#46.2 L?#4.2 R?#17.1
DGND: C?#41.1 NT?#2.2 U?#18.1(GND)
DVCC: C?#41.2 U?#18.3(VOUT)
PGND: C?#40.1 C?#44.1 C?#45.2 C?#46.1 C?#47.2 NT?#1.1 NT?#2.1 TP?#6.1 U?#19.4(COM)
USBGND: C?#42.1 C?#43.1 U?#19.2(Vin-)
USBVCC: C?#42.2 L?#2.2
NetC?#43_2: C?#43.2 L?#2.1 U?#19.1(Vin+)
NetC?#44_2: C?#44.2 L?#4.1 TP?#7.1 U?#19.3(Vout-)
NetC?#45_1: C?#45.1 L?#3.1 TP?#8.1 U?#19.5(Vout+)
NetD?#5_A: D?#5.A R?#18.2
NetD?#6_K: D?#6.K R?#17.2

### Notes on the sheet
- Low Dropout
- Voltage Regulators

### Library data of the parts
C?#40-C?#47 = C: Capacitor; Reviewed by: RM - 2018/08/05; Revision: July-2002: Re-released for DXP Platform.; Supplier 1: *; Supplier Part Number 1: *
  C?#40 C?#41: Value: 1uF
  C?#42 C?#46 C?#47: Value: 100nF
  C?#43-C?#45: Value: 10uF
D?#5 = LED GREEN: as D?#3 on sheet DSO_IO; Revision: July-2002: Re-released for DXP Platform.; Supplier 1: Digi-Key; Supplier Part Number 1: 160-1423-1-ND
D?#6 = LED RED: as D?#4 on sheet DSO_IO; Revision: July-2002: Re-released for DXP Platform.; Supplier 1: Digi-Key; Supplier Part Number 1: 475-1415-1-ND
L?#2-L?#4 = I: Inductor; Reviewed by: RM - 2018/08/05; Supplier 1: *; Supplier Part Number 1: *; Value: 300mA
NT?#1 NT?#2 = NET_TIE: Net Tie
R?#17 R?#18 = R: Resistor; Reviewed by: RM - 2018/08/05; Value: 330R; Supplier 1: *; Suppler Part Number 1: *
TP?#6-TP?#8 = WIRE: Pad
U?#18 = MCP1700T: Low Quiescent Current LDO, 3-Pin SOT-89, Extended Temperature, Tape and Reel; Reviewed by: RM - 2018/08/05; Supplier 1: Digi-Key; Supplier Part Number 1: MCP1700T3302EMBCT-ND
U?#19 = RD0505D: (ADV) DC to DC converter 5V in +-5V out; Reviewed by: RM - 2018/08/05; Supplier Part Number 1: 945-1136-ND; Supplier 1: Digi-Key

## Sheet DSO_RAM.SchDoc: Schematic_Name
size A4; CompanyName: University of Melbourne; Engineer: Your Name Here; DocumentNumber: 1; Revision: 0.1; SheetNumber: 1; SheetTotal: 1; Title_Project: Project_Title; StudentNo: Student No.
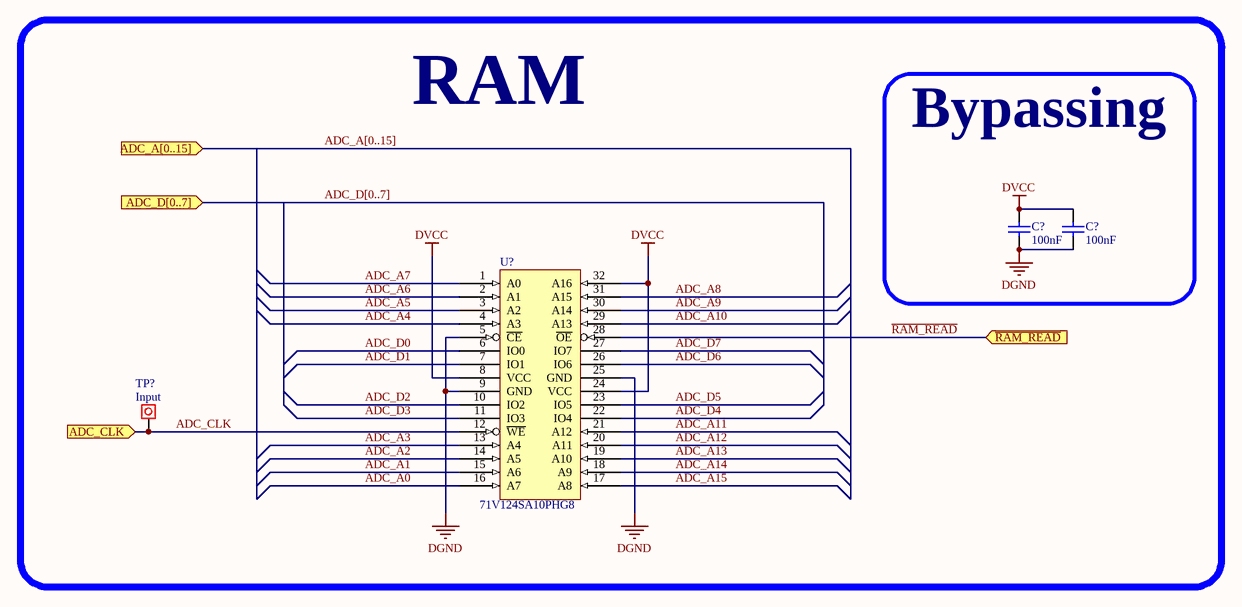
[diagram p9: DSO_RAM.SchDoc]

### Parts
(Parts that share a designator on the sheet are numbered #1, #2 ... from top to bottom, then left to right.)
C?#48  100nF  [0805C]
C?#49  100nF  [0805C]
TP?#9  INPUT  [Testpoin]
U?#20  71V124SA10PHG8  [TSOP-32]

### Blocks framed on the sheet
RAM: TP?#9 U?#20
Bypassing: C?#48 C?#49

### Ports
ADC_A[0..15] (in), ADC_CLK (in), ADC_D[0..7] (in), ~{RAM_READ} (in)

### Nets
DGND: C?#48.2 C?#49.2 U?#20.5(~{CE}) U?#20.9(GND) U?#20.25(GND)
DVCC: C?#48.1 C?#49.1 U?#20.8(VCC) U?#20.24(VCC) U?#20.32(A16)
ADC_A0: U?#20.16(A7)
ADC_A1: U?#20.15(A6)
ADC_A2: U?#20.14(A5)
ADC_A3: U?#20.13(A4)
ADC_A4: U?#20.4(A3)
ADC_A5: U?#20.3(A2)
ADC_A6: U?#20.2(A1)
ADC_A7: U?#20.1(A0)
ADC_A8: U?#20.31(A15)
ADC_A9: U?#20.30(A14)
ADC_A10: U?#20.29(A13)
ADC_A11: U?#20.21(A12)
ADC_A12: U?#20.20(A11)
ADC_A13: U?#20.19(A10)
ADC_A14: U?#20.18(A9)
ADC_A15: U?#20.17(A8)
ADC_CLK: TP?#9.1 U?#20.12(~{WE}) ; port ADC_CLK
ADC_D0: U?#20.6(IO0)
ADC_D1: U?#20.7(IO1)
ADC_D2: U?#20.10(IO2)
ADC_D3: U?#20.11(IO3)
ADC_D4: U?#20.22(IO4)
ADC_D5: U?#20.23(IO5)
ADC_D6: U?#20.26(IO6)
ADC_D7: U?#20.27(IO7)
~{RAM_READ}: U?#20.28(~{OE}) ; port ~{RAM_READ}

### Buses and harness runs
bus ADC_A[0..15] = port ADC_A[0..15]
bus ADC_D[0..7] = port ADC_D[0..7]

### Library data of the parts
C?#48 C?#49 = C: Capacitor; Reviewed by: RM - 2018/08/05; Revision: July-2002: Re-released for DXP Platform.; Value: 100nF; Supplier 1: *; Supplier Part Number 1: *
TP?#9 = Test Point: Pad; Value: Input
U?#20 = CY7C1019D: SRAM 128k x 8; Reviewed by: RM - 2018/08/05; Supplier 1: Digi-Key; Supplier Part Number 1: 428-1967-ND

## Sheet DSO_Trig.SchDoc: Schematic_Name
size A4; CompanyName: University of Melbourne; Engineer: Your Name Here; DocumentNumber: 1; Revision: 0.1; SheetNumber: 1; SheetTotal: 1; Title_Project: Project_Title; StudentNo: Student No.
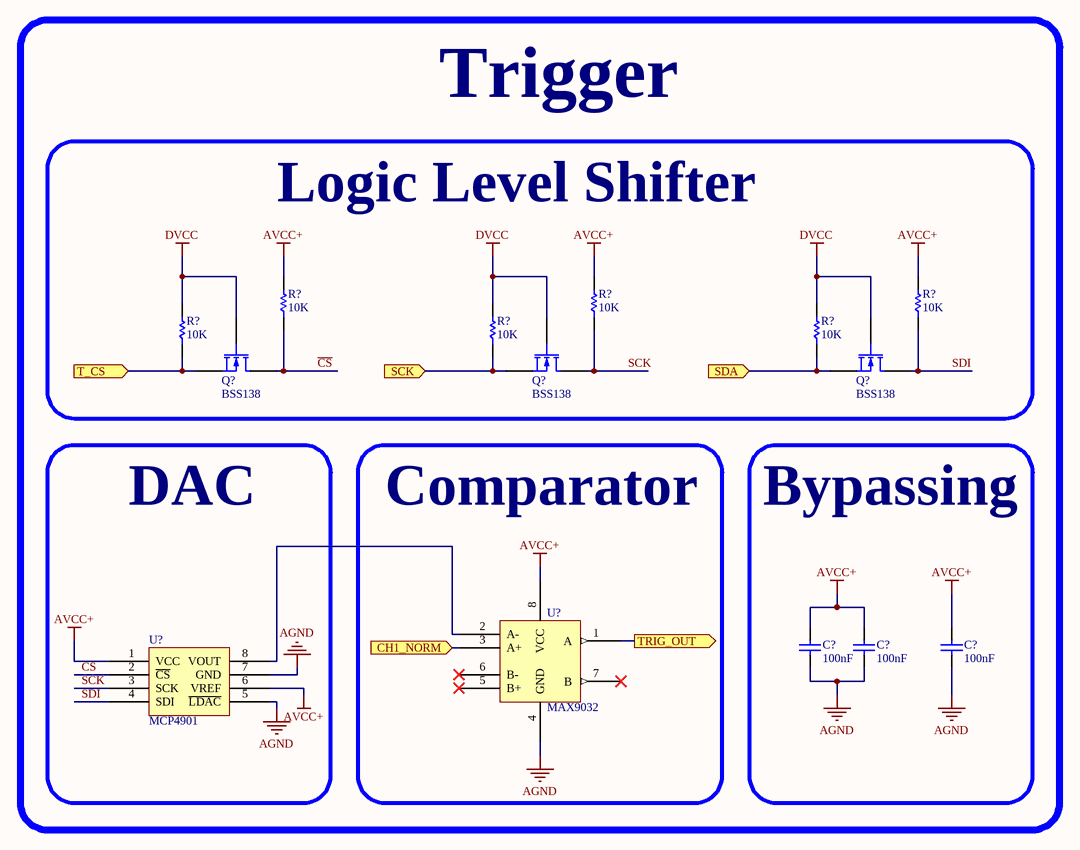
[diagram p10: DSO_Trig.SchDoc]

### Parts
(Parts that share a designator on the sheet are numbered #1, #2 ... from top to bottom, then left to right.)
C?#50  100nF  [0805C]
C?#51  100nF  [0805C]
C?#52  100nF  [0805C]
Q?#1  BSS138  [SOT23]
Q?#2  BSS138  [SOT23]
Q?#3  BSS138  [SOT23]
R?#19  10K  [0805]
R?#20  10K  [0805]
R?#21  10K  [0805]
R?#22  10K  [0805]
R?#23  10K  [0805]
R?#24  10K  [0805]
U?#21  MAX9032  [SOIC-8]
U?#22  MCP4901  [SOIC-8]

### Blocks framed on the sheet
Logic Level Shifter: Q?#1-Q?#3 R?#19-R?#24
DAC: U?#22
Comparator: U?#21
Bypassing: C?#50-C?#52

### Ports
CH1_NORM (in), SCK (in), SDA (in), T_CS (in), TRIG_OUT (out)

### Nets
AGND: C?#50.1 C?#51.1 C?#52.1 U?#21.4(GND) U?#22.5(~{LDAC}) U?#22.7(GND)
AVCC+: C?#50.2 C?#51.2 C?#52.2 R?#19.2 R?#20.2 R?#21.2 U?#21.8(VCC) U?#22.1(VCC) U?#22.6(VREF)
DVCC: Q?#1.1 Q?#2.1 Q?#3.1 R?#22.2 R?#23.2 R?#24.2
~{CS}: Q?#1.3 R?#19.1 U?#22.2(~{CS})
CH1_NORM: U?#21.3(A+) ; port CH1_NORM
SCK: Q?#2.2 R?#23.1 ; port SCK
SCK: Q?#2.3 R?#20.1 U?#22.3(SCK)  [a separate net that carries the same name]
SDA: Q?#3.2 R?#24.1 ; port SDA
SDI: Q?#3.3 R?#21.1 U?#22.4(SDI)
T_CS: Q?#1.2 R?#22.1 ; port T_CS
TRIG: U?#21.1(A) ; port TRIG_OUT
NetU?#21_2: U?#21.2(A-) U?#22.8(VOUT)

Not connected (* = marked no-connect by the designer): U?#21 5(B+)* 6(B-)* 7(B)*

### Notes on the sheet
- Trigger

### Library data of the parts
C?#50-C?#52 = C: Capacitor; Reviewed by: RM - 2018/08/05; Revision: July-2002: Re-released for DXP Platform.; Supplier 1: *; Supplier Part Number 1: *; Value: 100nF
Q?#1-Q?#3 = MOSFET-N: N-Channel MOSFET; PackageDocument: 1995/1996; Published: 8-Jun-2000; LatestRevisionDate: 17-Jul-2002; LatestRevisionNote: Re-released for DXP Platform.; PackageReference: E3; Publisher: Altium Limited
R?#19-R?#24 = R: Resistor; Reviewed by: RM - 2018/08/05; Supplier 1: *; Suppler Part Number 1: *; Value: 10K
U?#21 = MAX9032: Dual Comparator; Reviewed by: RM - 2018/08/05; Supplier 1: Digi-Key; Supplier Part Number 1: MAX9032ASA-ND
U?#22 = MCP4901: DAC 8bit SPI; Reviewed by: RM - 2018/08/05; Supplier 1: Digi-Key; Supplier Part Number 1: MCP4901-E/SN-ND

## Nets that join several sheets
AGND: DSO_ADC (16 pins), DSO_Front (6 pins), DSO_Power (D?#5.K D?#6.A NT?#1.2), DSO_Trig (6 pins)
AVCC+: DSO_ADC (7 pins), DSO_Front (D?#1.K U?#15.8), DSO_Power (5 pins), DSO_Trig (9 pins)
AVCC-: DSO_ADC (C?#9.2 C?#10.2 U?#1.4), DSO_Front (D?#2.A U?#15.4), DSO_Power (C?#46.2 L?#4.2 R?#17.1)
DGND: DSO_ADC (C?#13.1 C?#14.1 U?#5.10), DSO_Clock (C?#16.1 U?#6.3), DSO_Control (13 pins), DSO_Counters (U?#8.8 U?#8.14 U?#9.14), DSO_CPLD (27 pins), DSO_IO (C?#35.2 C?#38.2 C?#39.2 U?#17.5), DSO_Power (C?#41.1 NT?#2.2 U?#18.1), DSO_RAM (5 pins)
DVCC: DSO_ADC (C?#13.2 C?#14.2 U?#4.20 U?#5.20), DSO_Clock (C?#16.2 R?#10.1 U?#6.2), DSO_Control (13 pins), DSO_Counters (U?#8.16 U?#9.16), DSO_CPLD (7 pins), DSO_IO (C?#35.1 C?#38.1 C?#39.1 U?#17.8), DSO_Power (C?#41.2 U?#18.3), DSO_RAM (5 pins), DSO_Trig (6 pins)
GND: DSO_Control (P?#1.6), DSO_Counters (C?#23.2 C?#24.2 U?#9.8)
USBGND: DSO_IO (14 pins), DSO_Power (C?#42.1 C?#43.1 U?#19.2)
USBVCC: DSO_IO (11 pins), DSO_Power (C?#42.2 L?#2.2)
ADC_A0: DSO_Counters (U?#8.15), DSO_RAM (U?#20.16)
ADC_A1: DSO_Counters (U?#8.1), DSO_RAM (U?#20.15)
ADC_A2: DSO_Counters (U?#8.2), DSO_RAM (U?#20.14)
ADC_A3: DSO_Counters (U?#8.3), DSO_RAM (U?#20.13)
ADC_A4: DSO_Counters (U?#8.4), DSO_RAM (U?#20.4)
ADC_A5: DSO_Counters (U?#8.5), DSO_RAM (U?#20.3)
ADC_A6: DSO_Counters (U?#8.6), DSO_RAM (U?#20.2)
ADC_A7: DSO_Counters (U?#8.7), DSO_RAM (U?#20.1)
ADC_A8: DSO_Counters (U?#9.15), DSO_RAM (U?#20.31)
ADC_A9: DSO_Counters (U?#9.1), DSO_RAM (U?#20.30)
ADC_A10: DSO_Counters (U?#9.2), DSO_RAM (U?#20.29)
ADC_A11: DSO_Counters (U?#9.3), DSO_RAM (U?#20.21)
ADC_A12: DSO_Counters (U?#9.4), DSO_RAM (U?#20.20)
ADC_A13: DSO_Counters (U?#9.5), DSO_RAM (U?#20.19)
ADC_A14: DSO_Counters (U?#9.6), DSO_RAM (U?#20.18)
ADC_A15: DSO_Counters (U?#9.7), DSO_RAM (U?#20.17)
ADC_CLK: DSO_ADC (U?#4.10), DSO_CPLD (U?#11.41), DSO_RAM (TP?#9.1 U?#20.12)
ADC_D0: DSO_ADC (U?#5.18), DSO_Control (U?#7.30), DSO_RAM (U?#20.6)
ADC_D1: DSO_ADC (U?#5.17), DSO_Control (U?#7.31), DSO_RAM (U?#20.7)
ADC_D2: DSO_ADC (U?#5.16), DSO_Control (U?#7.32), DSO_RAM (U?#20.10)
ADC_D3: DSO_ADC (U?#5.15), DSO_Control (U?#7.33), DSO_RAM (U?#20.11)
ADC_D4: DSO_ADC (U?#5.14), DSO_Control (U?#7.34), DSO_RAM (U?#20.22)
ADC_D5: DSO_ADC (U?#5.13), DSO_Control (U?#7.35), DSO_RAM (U?#20.23)
ADC_D6: DSO_ADC (U?#5.12), DSO_Control (U?#7.36), DSO_RAM (U?#20.26)
ADC_D7: DSO_ADC (U?#5.11), DSO_Control (U?#7.37), DSO_RAM (U?#20.27)
CH1_BUF: DSO_ADC (R?#5.1), DSO_Front (TP?#5.1 U?#15.1 U?#15.2)
CH1_NORM: DSO_ADC (C?#1.1 R?#3.2 TP?#2.1 U?#4.17), DSO_Trig (U?#21.3)
CLEAR_COUNT: DSO_Counters (U?#8.10 U?#9.10), DSO_CPLD (U?#14.31)
COUNTER_CLK: DSO_Counters (U?#8.11 U?#8.13 U?#9.13), DSO_CPLD (U?#14.29)
EDGE_SW: DSO_Control (U?#7.15), DSO_CPLD (U?#11.5)
ENABLE: DSO_Control (U?#7.20), DSO_CPLD (U?#11.1)
ENABLE_COUNT: DSO_Counters (U?#8.12 U?#9.12), DSO_CPLD (U?#14.30)
FAST_CLK: DSO_Clock (U?#6.5), DSO_CPLD (U?#11.44)
FILL_COMP: DSO_Control (U?#7.26), DSO_CPLD (U?#14.28)
FORCE: DSO_Control (U?#7.19), DSO_CPLD (U?#11.2)
FULL: DSO_Counters (U?#9.9), DSO_CPLD (U?#11.7)
IN_CLK: DSO_Clock (U?#6.1), DSO_Control (U?#7.14)
PLL_S0: DSO_Clock (U?#6.6), DSO_Control (U?#7.12)
PLL_S1: DSO_Clock (U?#6.4), DSO_Control (U?#7.13)
~{RAM_READ}: DSO_CPLD (U?#11.6), DSO_RAM (U?#20.28)
RAM_READ: DSO_ADC (U?#5.1 U?#5.19), DSO_Control (U?#7.16), DSO_CPLD (U?#11.3)
RX: DSO_Control (U?#7.9), DSO_IO (U?#17.7)
SCK: DSO_Control (P?#1.3 U?#7.3), DSO_Trig (Q?#2.2 R?#23.1)
SDA: DSO_Control (P?#1.4 U?#7.1), DSO_Trig (Q?#3.2 R?#24.1)
SLOW_CLK: DSO_Control (U?#7.25), DSO_CPLD (U?#11.43)
T_CS: DSO_Control (U?#7.44), DSO_Trig (Q?#1.2 R?#22.1)
TRIG: DSO_CPLD (U?#11.12), DSO_Trig (U?#21.1)
TX: DSO_Control (U?#7.10), DSO_IO (U?#17.6)